# EAGLE design KREM Board (EAGLE 9.5.2)
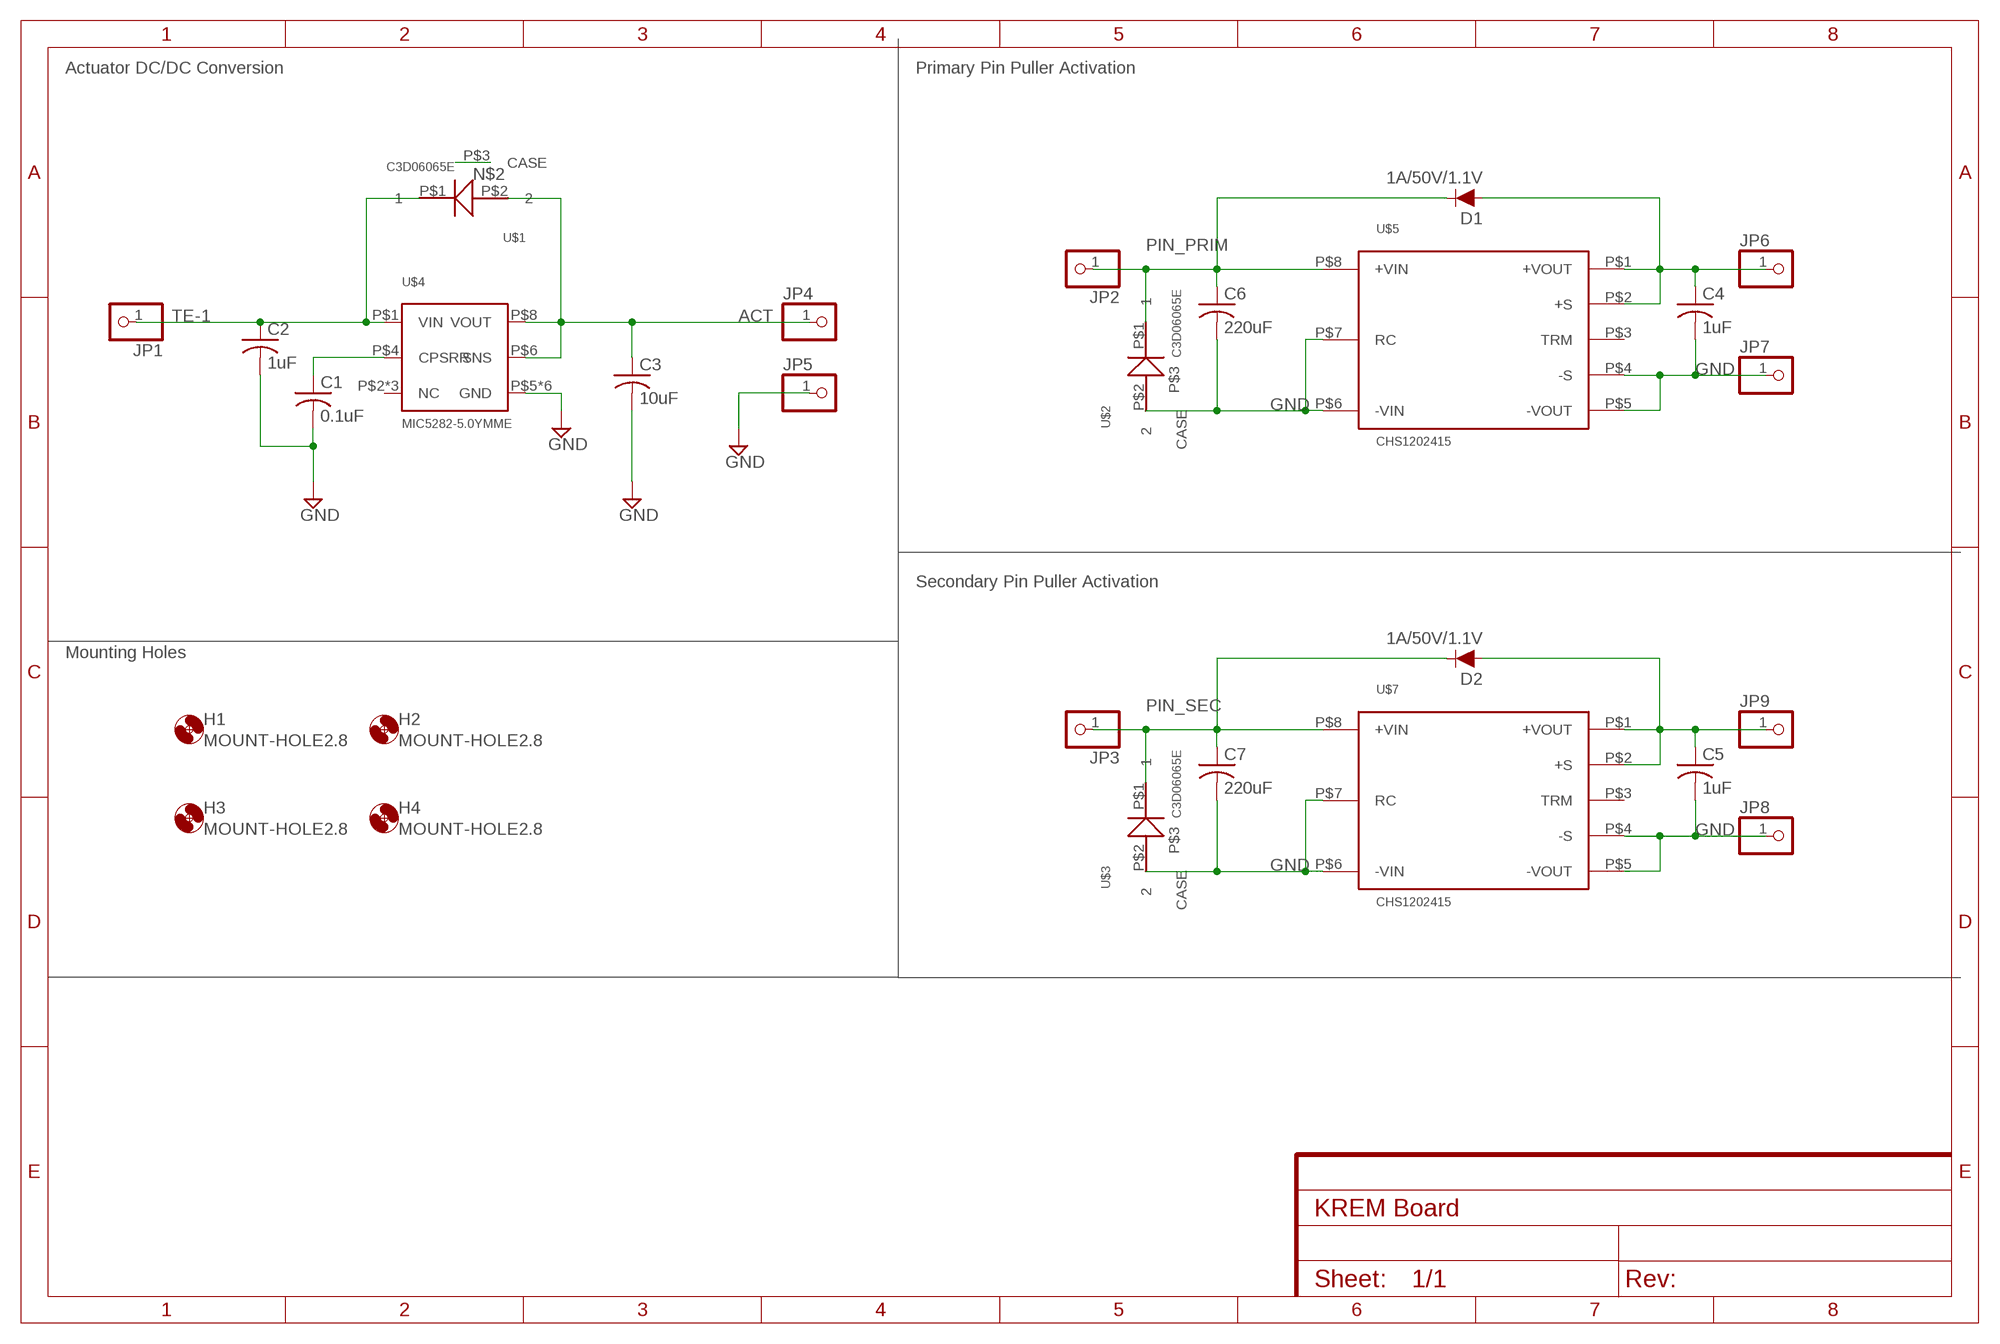
[diagram p0: schematic, sheet 1]

## Parts
C1  0.1uF  C-USC2220K  [C2220K]
C2  1uF  C-USC2220K  [C2220K]
C3  10uF  C-USC2220K  [C2220K]
C4  1uF  C-USC2220K  [C2220K]
C5  1uF  C-USC2220K  [C2220K]
C6  220uF  C-USC2220K  [C2220K]
C7  220uF  C-USC2220K  [C2220K]
D1  1A/50V/1.1V  DIODE-KIT2  [DIODE-1N4001-KIT]
D2  1A/50V/1.1V  DIODE-KIT2  [DIODE-1N4001-KIT]
H1  MOUNT-HOLE2.8  [2,8]
H2  MOUNT-HOLE2.8  [2,8]
H3  MOUNT-HOLE2.8  [2,8]
H4  MOUNT-HOLE2.8  [2,8]
JP1  PINHD-1X1  [1X01]
JP2  PINHD-1X1  [1X01]
JP3  PINHD-1X1  [1X01]
JP4  PINHD-1X1  [1X01]
JP5  PINHD-1X1  [1X01]
JP6  PINHD-1X1  [1X01]
JP7  PINHD-1X1  [1X01]
JP8  PINHD-1X1  [1X01]
JP9  PINHD-1X1  [1X01]
U$1  C3D06065E  [TO-252]
U$2  C3D06065E  [TO-252]
U$3  C3D06065E  [TO-252]
U$4  MIC5282-5.0YMME  [MSOP8-EPAD]
U$5  CHS1202415  [CHS1202415]
U$7  CHS1202415  [CHS1202415]

## Nets
ACT: C3.1 JP4.1 U$1.P$2 U$4.P$6(SNS) U$4.P$8(VOUT)
GND: C1.2 C2.2 C3.2 C4.2 C5.2 C6.2 C7.2 JP5.1 JP7.1 JP8.1 U$2.P$2 U$3.P$2 U$4.P$5(GND) U$4.P$9(GND) U$4.P$10(GND) U$4.P$11(GND) U$4.P$12(GND) U$4.P$13(GND) U$5.P$4(-S) U$5.P$5(-VOUT) U$5.P$6(-VIN) U$5.P$7(RC) U$7.P$4(-S) U$7.P$5(-VOUT) U$7.P$6(-VIN) U$7.P$7(RC)
N$2: U$1.P$3(CASE)
N$3: C1.1 U$4.P$4(CPSRR)
N$6: C4.1 D1.A JP6.1 U$5.P$1(+VOUT) U$5.P$2(+S)
N$9: C5.1 D2.A JP9.1 U$7.P$1(+VOUT) U$7.P$2(+S)
PIN_PRIM: C6.1 D1.C JP2.1 U$2.P$1 U$5.P$8(+VIN)
PIN_SEC: C7.1 D2.C JP3.1 U$3.P$1 U$7.P$8(+VIN)
TE-1: C2.1 JP1.1 U$1.P$1 U$4.P$1(VIN)
Unconnected: U$2.P$3(CASE) U$3.P$3(CASE) U$4.P$2(NC) U$4.P$3(NC) U$4.P$7(NC) U$5.P$3(TRM) U$7.P$3(TRM)

## Notes on the sheet
- Actuator DC/DC Conversion | Primary Pin Puller Activation
- Secondary Pin Puller Activation
- Mounting Holes

## Library data of the parts
C1-C7 = adafruit:C-US: CAPACITOR, American symbol
D1 D2 = SparkFun-DiscreteSemi:DIODE: Diode These are standard reverse protection diodes and small signal diodes. SparkFun Products: SparkFun SparkPunk Sound Kit <https://www.sparkfun.com/products/11177> SparkFun ESP8266 Thing <https://www.sparkfun.com/products/13231>; PROD_ID: DIO-09176
H1-H4 = holes:MOUNT-HOLE: MOUNTING HOLE with drill center marker
JP1-JP9 = adafruit:PINHD-1X1: Pin header 1x1 for 0.1" spacing With round pins
U$1-U$3 = TI_radio:C3D06065E
U$4 = TI_radio:MIC5282-5.0YMME
U$5 U$7 = KRUPS:CHS1202415

## Board
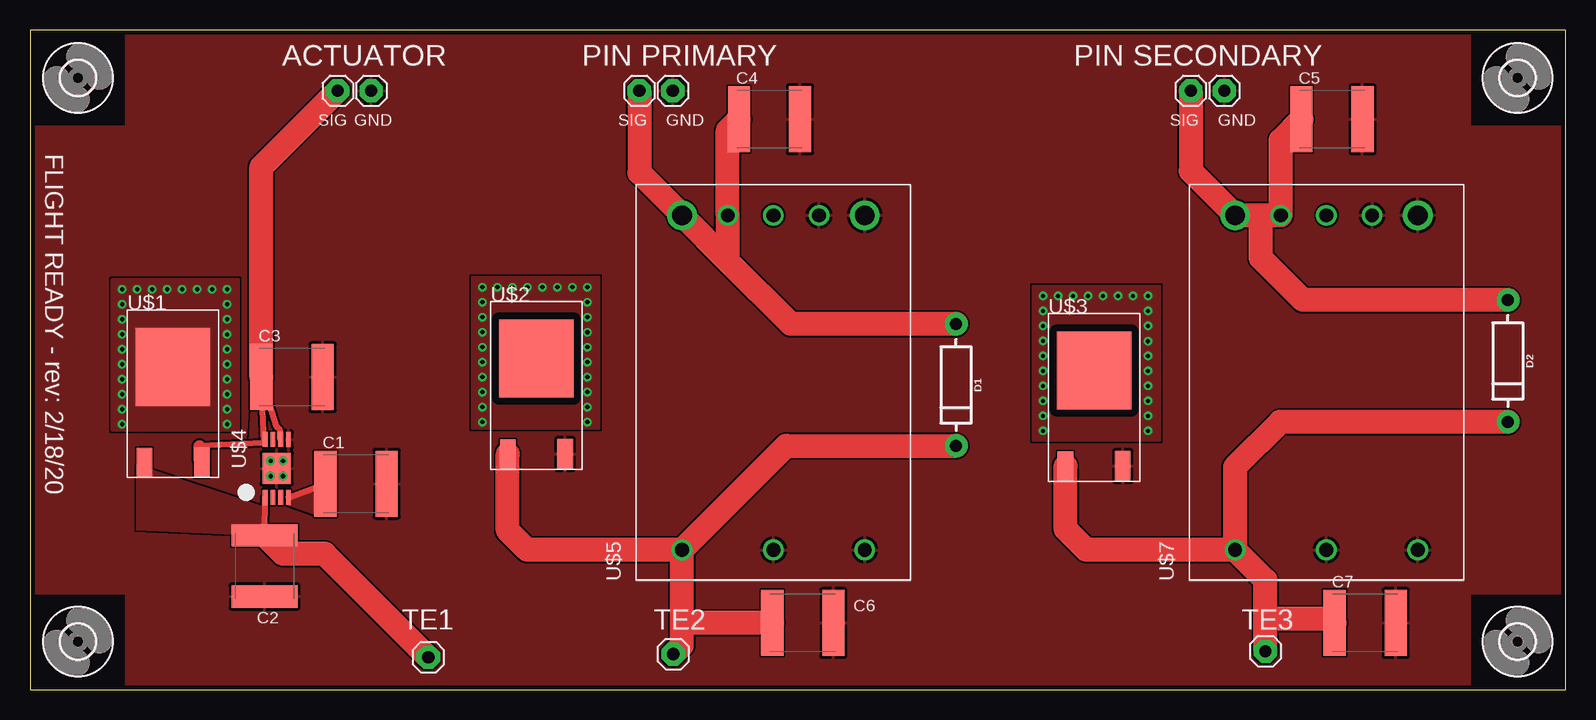
[diagram p1: board, top side]
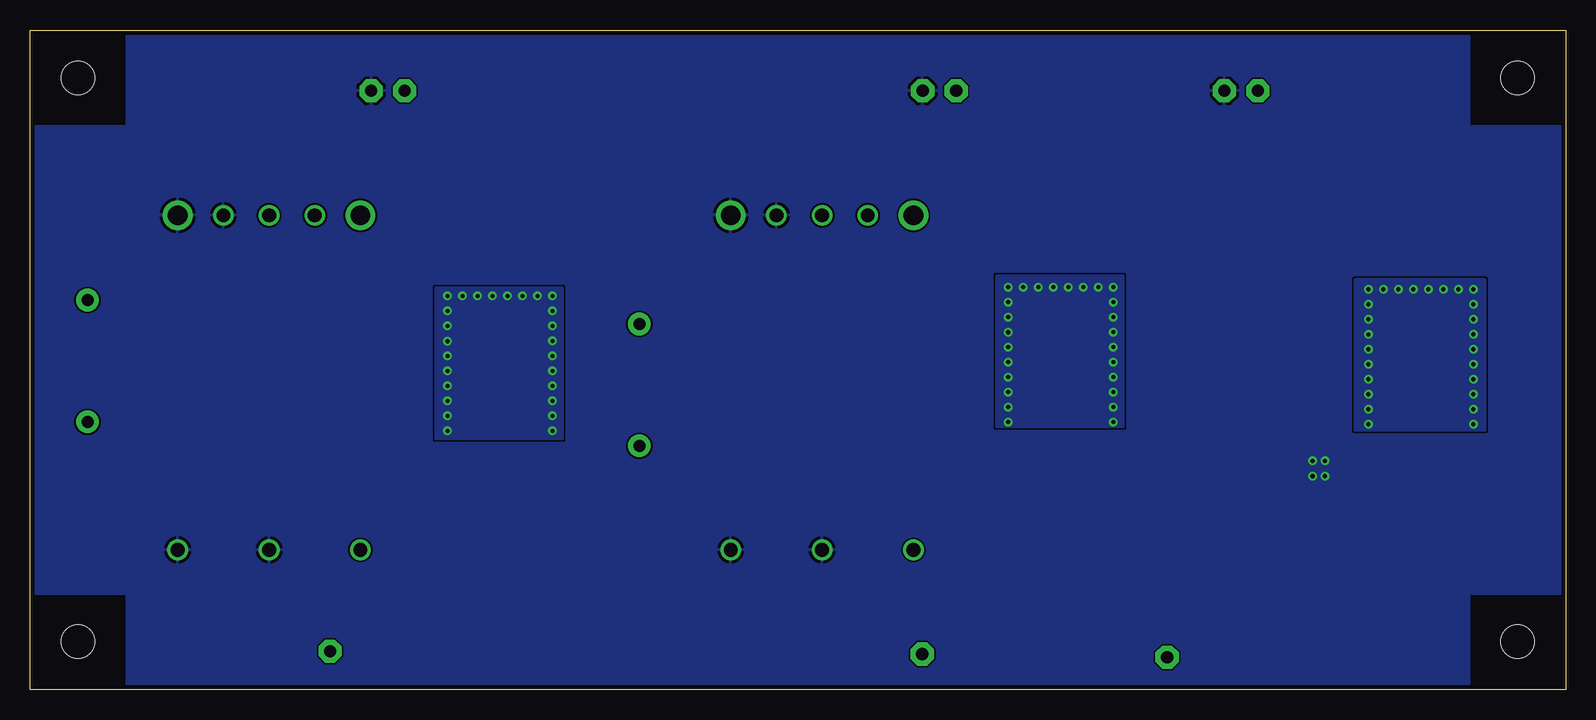
[diagram p2: board, bottom side, seen from below]

Size 128 x 55 mm. Coordinates in mm from the lower left corner, seen from the top.
Outline: 0,0 128,0 128,55 0,55 0,0
Copper layers (1*16): Top 0.0356mm / dielectric 1.5011mm / Bottom 0.0356mm
Design rules "oshpark-2layer *": minimum track width 6mil, minimum drill 13mil, track to track 6mil, track to pad 6mil, pad to pad 6mil, via to via 6mil, smd to smd 6mil, copper to edge 15mil, drill to drill 6mil, minimum pad ring 7mil, minimum via ring 7mil, stop-mask expansion 2.5mil, vias tented up to drill 0mil, thermal gap 10mil

### Footprints (pad centres in the part's own frame; a part is rotated, then mirrored left to right if it is on the bottom)
C2220K = smd 1.85 x 5.5: 1 -2.55,0; 2 2.55,0
DIODE-1N4001-KIT = drill 1.016 pad 1.88: A -5.08,0; C 5.08,0
2,8 = hole 2.8: 0,0
1X01 = drill 1.016 pad 1.93 octagon: 1 0,0
TO-252 = smd 1.3 x 2.4: P$1 -2.39,0 | smd 1.3 x 2.5: P$2 2.39,0 | smd 6.2 x 6.5: P$3 0,7.95
MSOP8-EPAD = smd 1.26 x 0.4: P$1 -2.405,0.975; P$2 -2.405,0.325; P$3 -2.405,-0.325; P$4 -2.405,-0.975; P$5 2.405,-0.975; P$6 2.405,-0.325; P$7 2.405,0.325; P$8 2.405,0.975 | smd 2.55 x 2.35: P$9 0,0 | drill 0.35: P$10 -0.635,0.508; P$11 0.635,0.508; P$12 0.635,-0.508; P$13 -0.635,-0.508
CHS1202415 = drill 1.65: P$1 0,15.24; P$5 0,0 | drill 1.15: P$2 0,11.43; P$3 0,7.62; P$4 0,3.81; P$6 -27.9,0; P$7 -27.9,7.62; P$8 -27.9,15.24

### Placement (x,y rotation side)
C1  27.17,17.16 0 top
C2  19.55,10.31 270 top
C3  21.84,26.05 0 top
C4  61.64,47.55 0 top
C5  108.53,47.55 0 top
C6  64.42,5.55 0 top
C7  111.31,5.55 0 top
D1  77.2,25.4 270 top
D2  123.2,27.4 270 top
H1  4,4 0 top
H2  4,51 0 top
H3  124,4 0 top
H4  124,51 0 top
JP1  33.21,2.69 90 top
JP2  53.62,2.96 90 top
JP3  102.99,3.19 90 top
JP4  25.65,49.93 0 top
JP5  28.44,49.93 0 top
JP6  50.79,49.93 0 top
JP7  53.59,49.93 0 top
JP8  99.56,49.93 0 top
JP9  96.77,49.93 0 top
U$1  11.93,18.94 0 top
U$2  42.21,19.63 0 top
U$3  88.7,18.63 0 top
U$4  20.57,18.43 90 top
U$5  69.59,39.55 90 top
U$7  115.69,39.55 90 top

### Tracks (layer width: path | path; a pad name or v marks a point on that pad's centre or on a via)
ACT
  Top 0.508: 19.52,20.56 C3.1 20.57,21.88 20.61,21.88 20.85,21.64 20.85,20.98 U$4.P$6 | 19.52,20.56 U$4.P$8 | 19.52,20.56 14.11,20.31
  Top 1.016: 14.11,20.31 14.11,19.15 U$1.P$2
  Top 2: C3.1 19.29,43.57 JP4.1
GND
  pour Top (rank 6): 0,47 8,47 8,55 120,55 120,47 128,47 128,8 120,8 120,0 8,0 8,8 0,8
  pour Bottom (rank 6): 0,47 8,47 8,55 120,55 120,47 128,47 128,8 120,8 120,0 8,0 8,8 0,8
N$1
  pour Top (no thermals): 21.08,20.72 21.08,21.74 20.06,24.53 18.54,24.53 18.28,20.72
N$2  (via drill 0.35)
  other vias: 7.68,22.13 7.68,23.38 7.68,24.63 7.68,25.88 7.68,27.13 7.68,28.38 7.68,29.63 7.68,30.88 7.68,32.13 7.68,33.38 8.93,33.38 10.18,33.38 11.43,33.38 12.68,33.38 13.93,33.38 15.18,33.38 16.43,33.38 16.43,32.13 16.43,30.88 16.43,29.61 16.43,28.38 16.43,27.13 16.43,25.88 16.43,24.63 16.43,23.38 16.43,22.13
  pour Top (isolate 0.61, no thermals): 17.37,34.22 17.37,21.59 6.87,21.59 6.87,34.22
  pour Bottom (isolate 0.61, no thermals): 6.74,34.22 6.74,21.59 17.51,21.59 17.51,34.22
N$3
  Top 0.508: U$4.P$4 C1.1
  pour Top (no thermals): 21.58,15.39 23.87,14.62 23.87,16.91 21.58,16.15
N$4  (via drill 0.35)
  other vias: 84.45,21.56 84.45,22.81 84.45,24.06 84.45,25.31 84.45,26.56 84.45,27.81 84.45,29.06 84.45,30.31 84.45,31.56 84.45,32.81 85.7,32.81 86.95,32.81 88.2,32.81 89.45,32.81 90.7,32.81 91.95,32.81 93.2,32.81 93.2,31.56 93.2,30.31 93.2,29.05 93.2,27.81 93.2,26.56 93.2,25.31 93.2,24.06 93.2,22.81 93.2,21.56
  pour Top (isolate 0.61, no thermals): 94.15,33.66 94.15,21.02 83.64,21.02 83.64,33.66
  pour Bottom (isolate 0.61, no thermals): 94.15,20.88 94.15,33.52 83.64,33.52 83.64,20.88
  pour Top (isolate 0.61, no thermals): 94.15,33.4 94.15,20.77 83.64,20.77 83.64,33.4
N$5  (via drill 0.35)
  other vias: 37.7,22.31 37.7,23.56 37.7,24.81 37.7,26.06 37.7,27.31 37.7,28.56 37.7,29.81 37.7,31.06 37.7,32.31 37.7,33.56 38.95,33.56 40.2,33.56 41.45,33.56 42.7,33.56 43.95,33.56 45.2,33.56 46.45,33.56 46.45,32.31 46.45,31.06 46.45,29.79 46.45,28.56 46.45,27.31 46.45,26.06 46.45,24.81 46.45,23.56 46.45,22.31
  pour Top (isolate 0.61, no thermals): 47.4,34.4 47.4,21.77 36.89,21.77 36.89,34.4
  pour Bottom (isolate 0.61, no thermals): 47.4,21.88 47.4,34.52 36.89,34.52 36.89,21.88
N$6
  Top 2: D1.A 63.42,30.48 58.16,35.74 | 58.16,35.74 U$5.P$1 50.79,43.1 JP6.1 | 58.16,35.74 U$5.P$2 58.16,46.62 C4.1
N$9
  Top 2: 102.6,39.55 U$7.P$1 96.77,43.23 JP9.1 | 102.6,39.55 U$7.P$2 104.26,45.83 C5.1 | D2.A 106.12,32.48 102.6,36 102.6,39.55
PIN_PRIM
  Top 2: JP2.1 54.35,3.69 54.35,5.6 | 54.35,5.6 U$5.P$8 | U$5.P$8 41.45,11.65 39.82,13.28 U$2.P$1 | C6.1 54.4,5.55 54.35,5.6 | U$5.P$8 63.02,20.32 D1.C
PIN_SEC
  Top 2: JP3.1 102.99,5.9 | 102.99,5.9 102.99,9.11 U$7.P$8 | C7.1 108.41,5.9 102.99,5.9 | U$7.P$8 88.05,11.65 86.31,13.39 U$3.P$1 | D2.C 104.22,22.32 100.45,18.55 U$7.P$8
TE-1
  Top 0.508: 19.57,12.84 U$4.P$1
  Top 1.27: 19.57,12.84 C2.1
  Top 2: C2.1 21.09,11.32 24.58,11.32 JP1.1
  pour Top (no thermals): 8.88,13.35 19.81,12.85 19.55,15.13 8.88,18.69

### Text on the board
tNames: ACTUATOR | PIN PRIMARY | PIN SECONDARY | SIG | GND | SIG | GND | SIG | GND | FLIGHT READY - rev: 2/18/20 | TE1 | TE2 | TE3